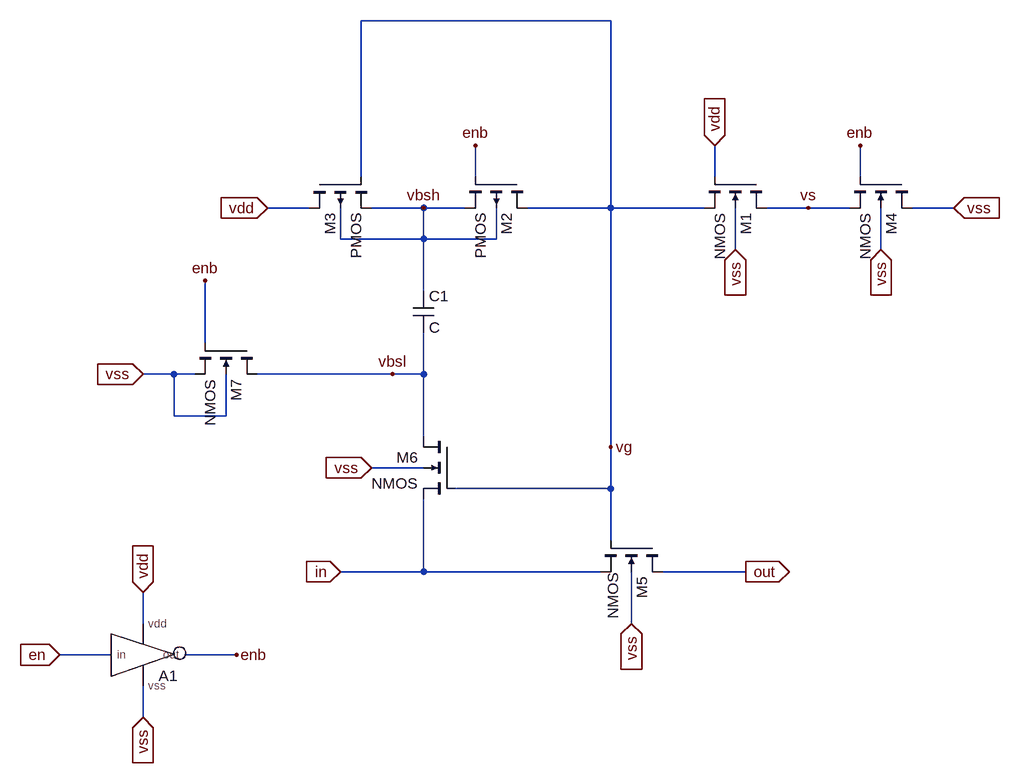
[diagram p0: schematic bootstrapped_sw.asc]
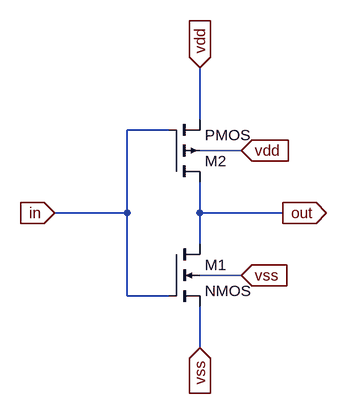
[diagram p1: sub-circuit inv_lvt.asc]
bootstrapped_sw.asc, the LTspice schematic file:
Version 4
SHEET 1 880 900
WIRE 48 -256 -336 -256
WIRE -336 -16 -336 -256
WIRE -160 -16 -160 -64
WIRE 208 -16 208 -64
WIRE 432 -16 432 -64
WIRE -416 32 -480 32
WIRE -240 32 -320 32
WIRE -176 32 -240 32
WIRE 48 32 48 -256
WIRE 48 32 -80 32
WIRE 192 32 48 32
WIRE 352 32 288 32
WIRE 416 32 352 32
WIRE 576 32 512 32
WIRE -368 80 -368 32
WIRE -240 80 -240 32
WIRE -240 80 -368 80
WIRE -128 80 -128 32
WIRE -128 80 -240 80
WIRE 240 96 240 32
WIRE 464 96 464 32
WIRE -240 160 -240 80
WIRE -576 240 -576 144
WIRE -624 288 -672 288
WIRE -592 288 -624 288
WIRE -288 288 -496 288
WIRE -240 288 -240 224
WIRE -240 288 -288 288
WIRE -624 352 -624 288
WIRE -544 352 -544 288
WIRE -544 352 -624 352
WIRE -240 384 -240 288
WIRE 48 400 48 32
WIRE -240 432 -320 432
WIRE 48 464 48 400
WIRE 48 464 -192 464
WIRE 48 544 48 464
WIRE -240 592 -240 480
WIRE -240 592 -368 592
WIRE 32 592 -240 592
WIRE 256 592 128 592
WIRE -672 672 -672 624
WIRE 80 672 80 592
WIRE -720 720 -800 720
WIRE -528 720 -608 720
WIRE -672 816 -672 768
FLAG 432 -64 enb
FLAG -528 720 enb
FLAG -576 144 enb
FLAG -672 288 vss
IOPIN -672 288 In
FLAG -320 432 vss
IOPIN -320 432 In
FLAG 80 672 vss
IOPIN 80 672 In
FLAG 464 96 vss
IOPIN 464 96 In
FLAG 240 96 vss
IOPIN 240 96 In
FLAG 576 32 vss
IOPIN 576 32 In
FLAG -480 32 vdd
IOPIN -480 32 In
FLAG 208 -64 vdd
IOPIN 208 -64 In
FLAG -240 32 vbsh
FLAG -288 288 vbsl
FLAG 48 400 vg
FLAG 352 32 vs
FLAG 256 592 out
IOPIN 256 592 Out
FLAG -368 592 in
IOPIN -368 592 In
FLAG -800 720 en
IOPIN -800 720 In
FLAG -160 -64 enb
FLAG -672 816 vss
IOPIN -672 816 In
FLAG -672 624 vdd
IOPIN -672 624 In
SYMBOL nmos4 288 -16 R90
SYMATTR InstName M1
SYMBOL pmos4 -80 -16 R90
SYMATTR InstName M2
SYMBOL pmos4 -416 -16 M90
SYMATTR InstName M3
SYMBOL nmos4 512 -16 R90
SYMATTR InstName M4
SYMBOL nmos4 128 544 R90
WINDOW 3 49 76 Left 2
SYMATTR InstName M5
SYMBOL nmos4 -192 384 M0
SYMATTR InstName M6
SYMBOL nmos4 -496 240 R90
SYMATTR InstName M7
SYMBOL cap -256 160 R0
SYMATTR InstName C1
SYMBOL inv_lvt -656 720 R0
WINDOW 0 8 32 Left 2
WINDOW 3 8 104 Left 2
SYMATTR InstName A1
SYMATTR Prefix A
SYMATTR SpiceModel BUF
SYMATTR Description Behavioral Inverter

inv_lvt.asc, the sub-circuit schematic file:
Version 4
SHEET 1 880 680
WIRE 272 -16 272 -96
WIRE 224 0 160 0
WIRE 336 32 272 32
WIRE 160 128 160 0
WIRE 160 128 48 128
WIRE 272 128 272 80
WIRE 400 128 272 128
WIRE 272 176 272 128
WIRE 336 224 272 224
WIRE 160 256 160 128
WIRE 224 256 160 256
WIRE 272 336 272 272
FLAG 272 -96 vdd
IOPIN 272 -96 In
FLAG 272 336 vss
IOPIN 272 336 In
FLAG 336 32 vdd
IOPIN 336 32 In
FLAG 336 224 vss
IOPIN 336 224 In
FLAG 400 128 out
IOPIN 400 128 Out
FLAG 48 128 in
IOPIN 48 128 In
SYMBOL nmos4 224 176 R0
SYMATTR InstName M1
SYMBOL pmos4 224 80 M180
SYMATTR InstName M2

The netlist it stands for:
* bootstrapped_sw.asc
M1 vs vdd vg vss NMOS
M2 vg enb vbsh vbsh PMOS
M3 vdd vg vbsh vbsh PMOS
M4 vss enb vs vss NMOS
M5 out vg in vss NMOS
M6 vbsl vg in vss NMOS
M7 vbsl enb vss vss NMOS
C1 vbsh vbsl C
A1 en vdd vss enb 0 0 0 0 inv_lvt

* block symbol definitions
.subckt inv_lvt in vdd vss out
M1 out in vss vss NMOS
M2 out in vdd vdd PMOS
.ends inv_lvt

.model NMOS NMOS
.model PMOS PMOS
.lib standard.mos
.backanno
.end